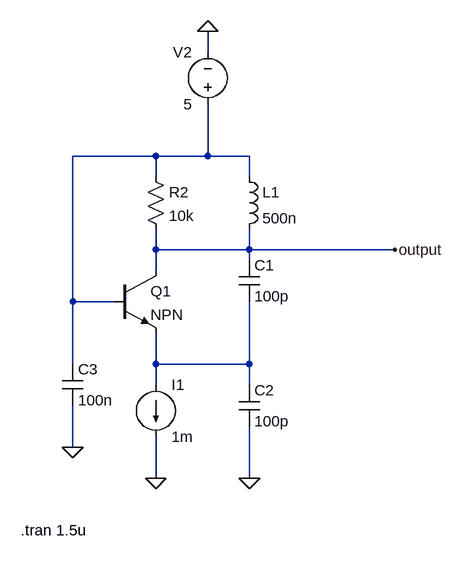
[diagram p0: schematic Colpitts 2N2222.asc]
Colpitts 2N2222.asc, the LTspice schematic file:
Version 4
SHEET 1 880 680
WIRE 224 -112 224 -144
WIRE 144 48 16 48
WIRE 224 48 224 -32
WIRE 224 48 144 48
WIRE 288 48 224 48
WIRE 144 80 144 48
WIRE 288 80 288 48
WIRE 144 192 144 160
WIRE 288 192 288 160
WIRE 288 192 144 192
WIRE 512 192 288 192
WIRE 288 208 288 192
WIRE 144 224 144 192
WIRE 16 272 16 48
WIRE 80 272 16 272
WIRE 16 368 16 272
WIRE 144 368 144 320
WIRE 288 368 288 272
WIRE 288 368 144 368
WIRE 144 400 144 368
WIRE 288 400 288 368
WIRE 16 496 16 432
WIRE 144 544 144 480
WIRE 288 544 288 464
FLAG 512 192 output
FLAG 224 -144 0
FLAG 144 544 0
FLAG 288 544 0
FLAG 16 496 0
SYMBOL res 128 64 R0
SYMATTR InstName R2
SYMATTR Value 10k
SYMBOL cap 272 208 R0
SYMATTR InstName C1
SYMATTR Value 100p
SYMBOL cap 272 400 R0
SYMATTR InstName C2
SYMATTR Value 100p
SYMBOL ind 272 64 R0
SYMATTR InstName L1
SYMATTR Value 500n
SYMBOL Voltage 224 -16 R180
WINDOW 0 24 96 Left 2
WINDOW 3 24 16 Left 2
SYMATTR InstName V2
SYMATTR Value 5
SYMBOL current 144 400 R0
SYMATTR InstName I1
SYMATTR Value 1m
SYMBOL cap 0 368 R0
SYMATTR InstName C3
SYMATTR Value 100n
SYMBOL npn 80 224 R0
SYMATTR InstName Q1
TEXT -64 624 Left 2 !.tran 1.5u

The netlist it stands for:
* Colpitts 2N2222.asc
R2 N001 output 10k
C1 output N002 100p
C2 N002 0 100p
L1 N001 output 500n
V2 N001 0 5
I1 N002 0 1m
C3 N001 0 100n
Q1 output N001 N002 0 NPN
.model NPN NPN
.model PNP PNP
.lib standard.bjt
.tran 1.5u
.backanno
.end